# Altium schematic sheet Sheet1.SchDoc
size A; SheetNumber: 1; SheetTotal: 1
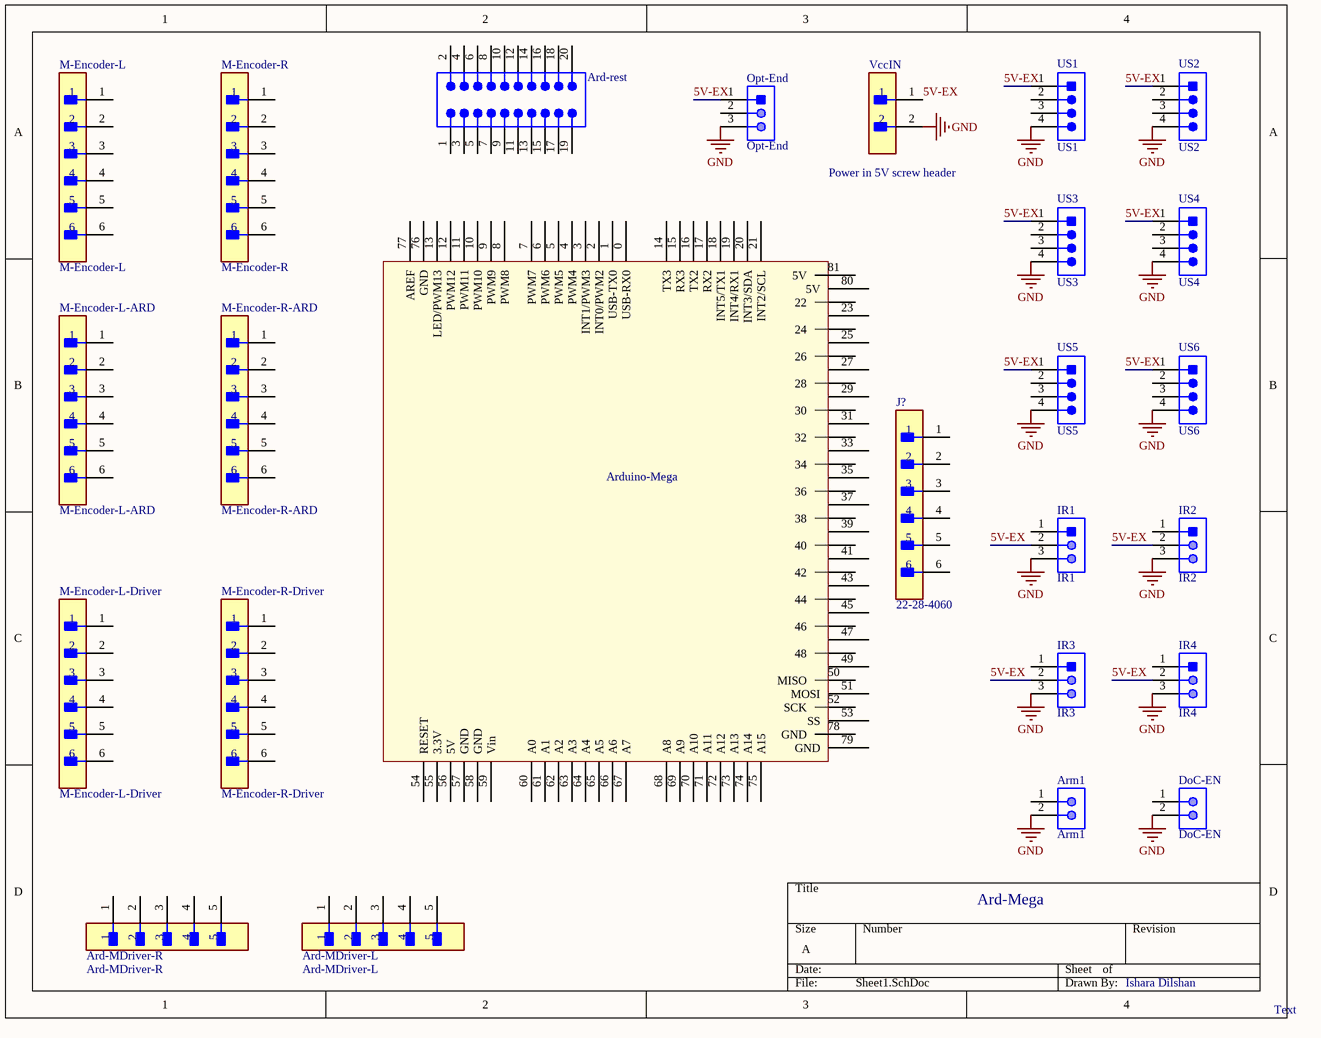
[diagram p0: Sheet1.SchDoc]

## Parts
Ard-MDriver-L  Ard-MDriver-L  [FP-90120-0125-MFG]
Ard-MDriver-R  Ard-MDriver-R  [FP-90120-0125-MFG]
Ard-rest  (no value)  [61302021121]
Arduino-Mega  (no value)  [Arduino Mega]
Arm1  Arm1  [MOLX-22-23-2021_V]
DoC-EN  DoC-EN  [MOLX-22-23-2021_V]
IR1  IR1  [MOLX-22-28-4033_V]
IR2  IR2  [MOLX-22-28-4033_V]
IR3  IR3  [MOLX-22-28-4033_V]
IR4  IR4  [MOLX-22-28-4033_V]
J?  22-28-4060  [FP-22-28-4060-MFG]
M-Encoder-L  M-Encoder-L  [FP-22-28-4060-MFG]
M-Encoder-L-ARD  M-Encoder-L-ARD  [FP-22-28-4060-MFG]
M-Encoder-L-Driver  M-Encoder-L-Driver  [FP-22-28-4060-MFG]
M-Encoder-R  M-Encoder-R  [FP-22-28-4060-MFG]
M-Encoder-R-ARD  M-Encoder-R-ARD  [FP-22-28-4060-MFG]
M-Encoder-R-Driver  M-Encoder-R-Driver  [FP-22-28-4060-MFG]
Opt-End  Opt-End  [MOLX-22-28-4033_V]
US1  US1  [TECO-280371-2_V]
US2  US2  [TECO-280371-2_V]
US3  US3  [TECO-280371-2_V]
US4  US4  [TECO-280371-2_V]
US5  US5  [TECO-280371-2_V]
US6  US6  [TECO-280371-2_V]
VccIN  Power in 5V screw header  [FP-53375-0210-MFG]

## Nets
GND: Arm1.2 DoC-EN.2 IR1.3 IR2.3 IR3.3 IR4.3 Opt-End.3 US1.4 US2.4 US3.4 US4.4 US5.4 US6.4 VccIN.2
5V-EX: IR1.2 IR2.2 IR3.2 IR4.2 Opt-End.1 US1.1 US2.1 US3.1 US4.1 US5.1 US6.1 VccIN.1

Not connected (* = marked no-connect by the designer): Ard-MDriver-L 1 2 3 4 5; Ard-MDriver-R 1 2 3 4 5; Ard-rest 1 2 3 4 5 6 7 8 9 10 11 12 13 14 15 16 17 18 19 20; Arduino-Mega 0(USB-RX0) 1(USB-TX0) 2(INT0/PWM2) 3(INT1/PWM3) 4(PWM4) 5(PWM5) 6(PWM6) 7(PWM7) 8(PWM8) 9(PWM9) 10(PWM10) 11(PWM11) 12(PWM12) 13(LED/PWM13) 14(TX3) 15(RX3) 16(TX2) 17(RX2) 18(INT5/TX1) 19(INT4/RX1) 20(INT3/SDA) 21(INT2/SCL) 22 23 24 25 26 27 28 29 30 31 32 33 34 35 36 37 38 39 40 41 42 43 44 45 46 47 48 49 50(MISO) 51(MOSI) 52(SCK) 53(SS) 54(RESET) 55(3.3V) 56(5V) 57(GND) 58(GND) 59(Vin) 60(A0) 61(A1) 62(A2) 63(A3) 64(A4) 65(A5) 66(A6) 67(A7) 68(A8) 69(A9) 70(A10) 71(A11) 72(A12) 73(A13) 74(A14) 75(A15) 76(GND) 77(AREF) 78(GND) 79(GND) 80(5V) 81(5V); Arm1 1; DoC-EN 1; IR1 1; IR2 1; IR3 1; IR4 1; J? 1 2 3 4 5 6; M-Encoder-L 1 2 3 4 5 6; M-Encoder-L-ARD 1 2 3 4 5 6; M-Encoder-L-Driver 1 2 3 4 5 6; M-Encoder-R 1 2 3 4 5 6; M-Encoder-R-ARD 1 2 3 4 5 6; M-Encoder-R-Driver 1 2 3 4 5 6; Opt-End 2; US1 2 3; US2 2 3; US3 2 3; US4 2 3; US5 2 3; US6 2 3

## Notes on the sheet
- Ard-Mega
- Ishara Dilshan
- Text

## Library data of the parts
Ard-MDriver-L Ard-MDriver-R = CMP-00257-00655425-1: 90120-0125 2.54mm Pitch C-Grid III Header, Single Row, Vertical, 5 Circuits, Tin (Sn) Plating; NexarPartId: 655425; Manufacturer Lifecycle Status: ACTIVE; Lead Length: 2.9mm; Number of Positions: 5; Current Rating: 3A; Mating Post Length: 6.75mm; Glow Wire Compliant: Non-compliant; Contact Resistance: 20mΩ; Voltage Rating: 350V; Gender: Male; Max Voltage Rating (DC): 350.35kV; Max Operating Temperature: 125°C; Number of Pins: 5; Plating: Tin; Contact Material: Brass; Mount: Through Hole; Contact Gender: Male; Packaging: Bulk; Schedule B: 8536694040; Lifecycle Status: Production; Lead Pitch: 2.54mm; Radiation Hardening: No; Orientation: Vertical; Min Operating Temperature: -55°C; Country of Origin: SK; Housing Color: Black; REACH SVHC: No SVHC; Contact Plating: Tin; Number of Rows: 1; Number of Circuits: 5; Termination: Solder; Number of Contacts: 5; Pitch: 2.54mm; Housing Material: Polyester; RoHS: Compliant; Lead Free: Lead Free; Voltage Rating (AC): 350V
Ard-rest = CMP-1502-01104-3: NexarPartId: 32855556; Current Rating: 3A; Operating Supply Voltage: 250V; Contact Resistance: 20mΩ; Gender: Male; Number of Positions: 20; Connector Type: Male Pin; Row Spacing: 2.54mm; Contact Material: Copper; Number of Rows: 2; Lead Pitch: 2.54mm; Packaging: Bulk; Mount: Through Hole; Number of Pins: 20; Contact Mating Length: 5.9944mm; Number of Contacts: 20; Pitch: 2.54mm; Color: Black; Contact Plating: Gold; Orientation: Vertical; Termination: Solder; REACH SVHC: Unknown; RoHS: Compliant
Arduino-Mega = ARDUINO MEGA
Arm1 DoC-EN = CMP-1704-00001-3: Male Header, Pitch 2.54 mm, 1 x 2 Position, Height 10.67 mm, Tail Length 3.56 mm, 0 to 75 degC, RoHS, Bulk; Package Quantity: 3000; Height: 10.67 mm; RoHSCompliant: True; ComponentLink2URL: https://datasheet.ciiva.com/19454/232266-19454304.pdf; PartNumber: 22-23-2021; Packaging: Bulk; ComponentLink2Description: Datasheet; Min Operating Temperature: 0 degC; ComponentLink1Description: Manufacturer URL; Length: 5.08 mm; Mounting Technology: Through Hole; Max Operating Temperature: 75 degC; REACH SVHC: Unknown; PackageDescription: Male Header, Pitch 2.54 mm, 1 x 2 Position, Height 10.67 mm, Tail Length 3.56 mm; ComponentLink1URL: http://www.molex.com/; Mount: Through Hole; Radiation Hardening: No; Width: 6.35 mm; Pins: 2
IR1-IR4 Opt-End = CMP-1676-00001-5: Male Header, Pitch 2.54 mm, 1 x 3 Position, Height 8.38 mm, Tail Length 3.18 mm, RoHS, Bulk; Manufacturer: Molex; Rows: 1; Voltage Rating: 250 V; Current Rating: 4 A; Min Operating Temperature: 0 degC; Lead Pitch: 0.1 inch; Packaging: Bulk; Contact Finish: Gold; RoHSCompliant: true; Contact Material: Brass; PackageReference: 22-28-4033; REACH SVHC: Unknown; PackageDescription: Male Header, Pitch 2.54 mm, 1 x 3 Position, Height 8.38 mm, Tail Length 3.18 mm; ComponentLink2URL: http://www.molex.com/pdm_docs/sd/022284033_sd.pdf; Height: 8.38 mm; Mounting Technology: Through Hole; ComponentLink1Description: Manufacturer URL; Length: 7.62 mm; Mount: Through Hole; DatasheetVersion: Rev. G, 01/2012; Max Operating Temperature: 75 degC; ComponentLink2Description: Datasheet; Colour: Black; Pins: 3; Contact Plating: Gold; Package Quantity: 1; ComponentLink1URL: http://www.molex.com/
J? M-Encoder-L M-Encoder-L-ARD M-Encoder-L-Driver M-Encoder-R M-Encoder-R-ARD M-Encoder-R-Driver = CMP-04776-000763-1: CONN HEADER VERT 6POS 2.54MM; Voltage Rating: 250V; Current Rating: 4A; Number of Contacts: 6; Max Voltage Rating (DC): 250.25kV; Gender: Male; Contact Resistance: 20mR; Connector Type: Male Pin; Color: Black; Max Voltage Rating (AC): 250V; Pitch: 2.54mm; Orientation: Straight; Max Operating Temperature: 75°C; Contact Plating: Tin; Depth: 2.49mm; Contact Type: Male Pin; Number of Positions: 6; Length: 15.24mm; Packaging: Bulk; Mount: Through Hole; Housing Material: Thermoplastic; Housing Color: Black; Termination: Solder; Contact Material: Brass; Min Operating Temperature: 0°C; Series: KK® 42375; Number of Rows: 1; Package Quantity: 1; RoHS Compliant: Yes; Contact Mating Length: 0.24inch
US1-US6 = CMP-2000-05548-1: Male Header, Pitch 2.54 mm, 1 x 4 Position, Height 12.8 mm, Tail Length 3.5 mm, -55 to 105 degC, RoHS, Bulk; Manufacturer: TE Connectivity; Pitch: 0.100"(2.54mm); Connector Type: Header,Shrouded; Other Names: 280371-2-ND / A106401; Number of Positions Loaded: All; Dynamic Catalog: AMPMODUModIISeries; Number of Positions: 4; 3D Model: 280371-2.pdf; Termination: Solder; Package Description: Male Header, Pitch 2.54 mm, 1 x 4 Position, Height 12.8 mm, Tail Length 3.5 mm; Datasheet Version: Rev. M1, 08/2016; Contact Mating Length: 0.260"(6.60mm); Datasheet URL: http://www.te.com/commerce/DocumentDelivery/DDEController?Action=showdoc&DocId=Customer+Drawing%7F280370%7FM1%7Fpdf%7FEnglish%7FENG_CD_280370_M1.pdf%7F280371-2; Mounting Technology: ThroughHole; Standard Package: 1,000; Contact Finish Thickness: 15µin(0.38µm); Contact Finish: Gold; Contact Type: MalePin; Packaging: Bulk; Mounting Type: ThroughHole; Number of Rows: 1; Family: RectangularConnectors-Headers,MalePins; Manufacturer URL: http://www.te.com/; Color: Black; RoHS Information: 280371-2StatementofCompliance; Package Reference: 280371-2; Category: Connectors,Interconnects; Series: AMPMODUModII
VccIN = CMP-04776-000250-1: CONN HEADER VERT 2POS 2.5MM; Voltage Rating: 250V; Contact Resistance: 20mR; Number of Positions: 2; Gender: Male; Glow Wire Compliant: Non-compliant; Current Rating: 3A; Min Operating Temperature: -40°C; Contact Plating: Tin; Radiation Hardening: No; Termination: Through Hole; Contact Gender: Male; Color: White; Series: Mini-Lock; Package Quantity: 2500; Packaging: Bulk; Mount: Through Hole; Number of Contacts: 2; Number of Circuits: 2; Max Operating Temperature: 105°C; Pitch: 2.5mm; Housing Material: Polyester; Max Voltage Rating (AC): 250V; Orientation: Vertical; Contact Material: Bronze; Number of Rows: 1